# EAGLE design project (EAGLE 9.6.2)
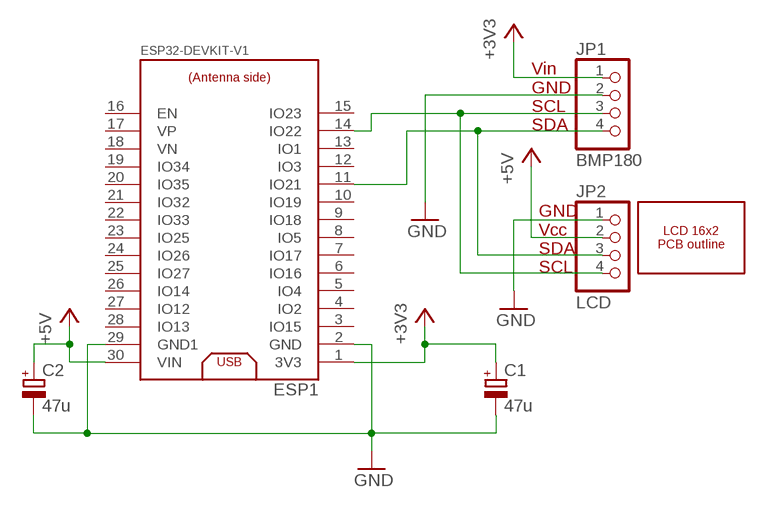
[diagram p0: schematic, sheet 1]

## Parts
C1  47u  CPOL-EUE2,5-6E  [E2,5-6E]
C2  47u  CPOL-EUE2,5-6E  [E2,5-6E]
ESP1  ESP32DEVKITV1  [ESP32-DEVKITV1]
JP1  BMP180  PINHD-1X4  [1X04]
JP2  LCD  PINHD-1X4  [1X04]
LCD1  OUTLINES  [LCD162-OUTLINE]

## Nets
+3V3: C1.+ ESP1.1(3V3) JP1.1
+5V: C2.+ ESP1.30(VIN) JP2.2
GND: C1.- C2.- ESP1.2(GND) ESP1.29(GND1) JP1.2 JP2.1
N$2: ESP1.14(IO22) JP1.3 JP2.4
N$3: ESP1.11(IO21) JP1.4 JP2.3
Unconnected: ESP1.3(IO15) ESP1.4(IO2) ESP1.5(IO4) ESP1.6(IO16) ESP1.7(IO17) ESP1.8(IO5) ESP1.9(IO18) ESP1.10(IO19) ESP1.12(IO3) ESP1.13(IO1) ESP1.15(IO23) ESP1.16(EN) ESP1.17(VP) ESP1.18(VN) ESP1.19(IO34) ESP1.20(IO35) ESP1.21(IO32) ESP1.22(IO33) ESP1.23(IO25) ESP1.24(IO26) ESP1.25(IO27) ESP1.26(IO14) ESP1.27(IO12) ESP1.28(IO13)

## Notes on the sheet
- Vin
  GND
  SCL
  SDA
- GND
  Vcc
  SDA
  SCL

## Library data of the parts
C1 C2 = rcl:CPOL-EU: POLARIZED CAPACITOR, European symbol; SPICEPREFIX: C
ESP1 = ESP32:ESP32DEVKITV1
JP1 JP2 = pinhead:PINHD-1X4: PIN HEADER
LCD1 = LCD-obrys:OUTLINES

## Board
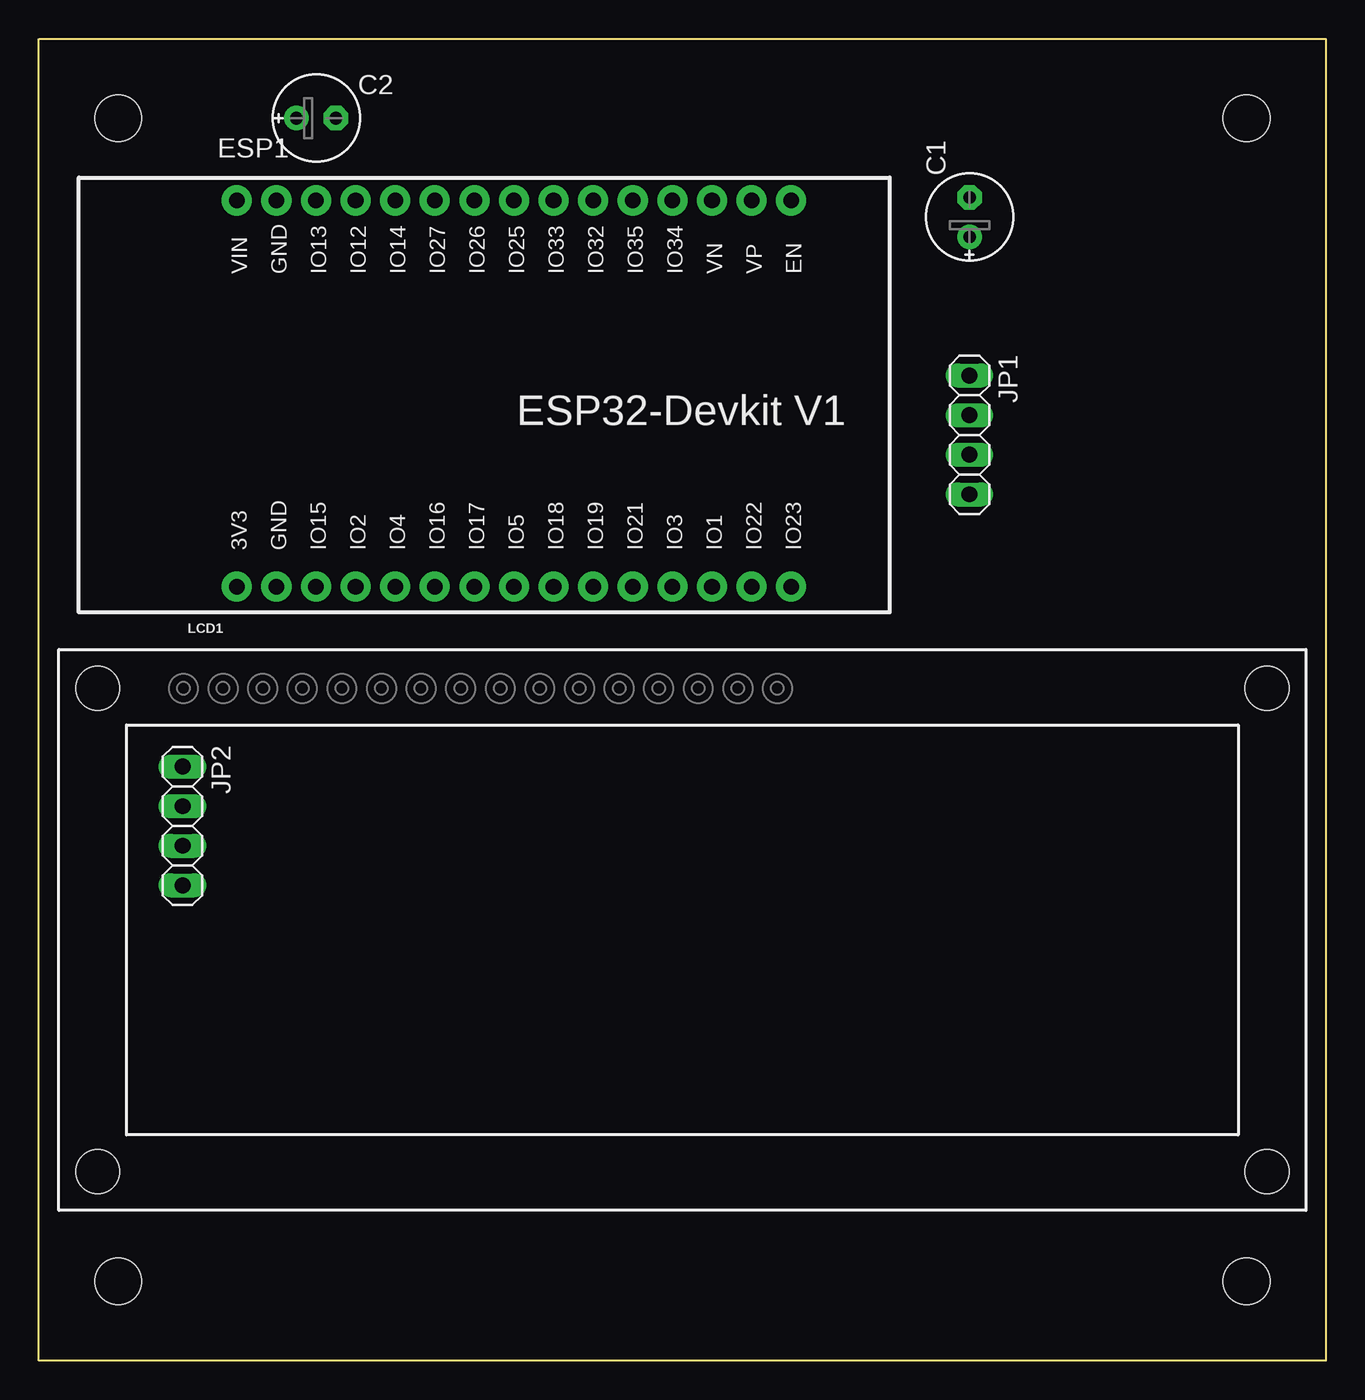
[diagram p1: board, top side]
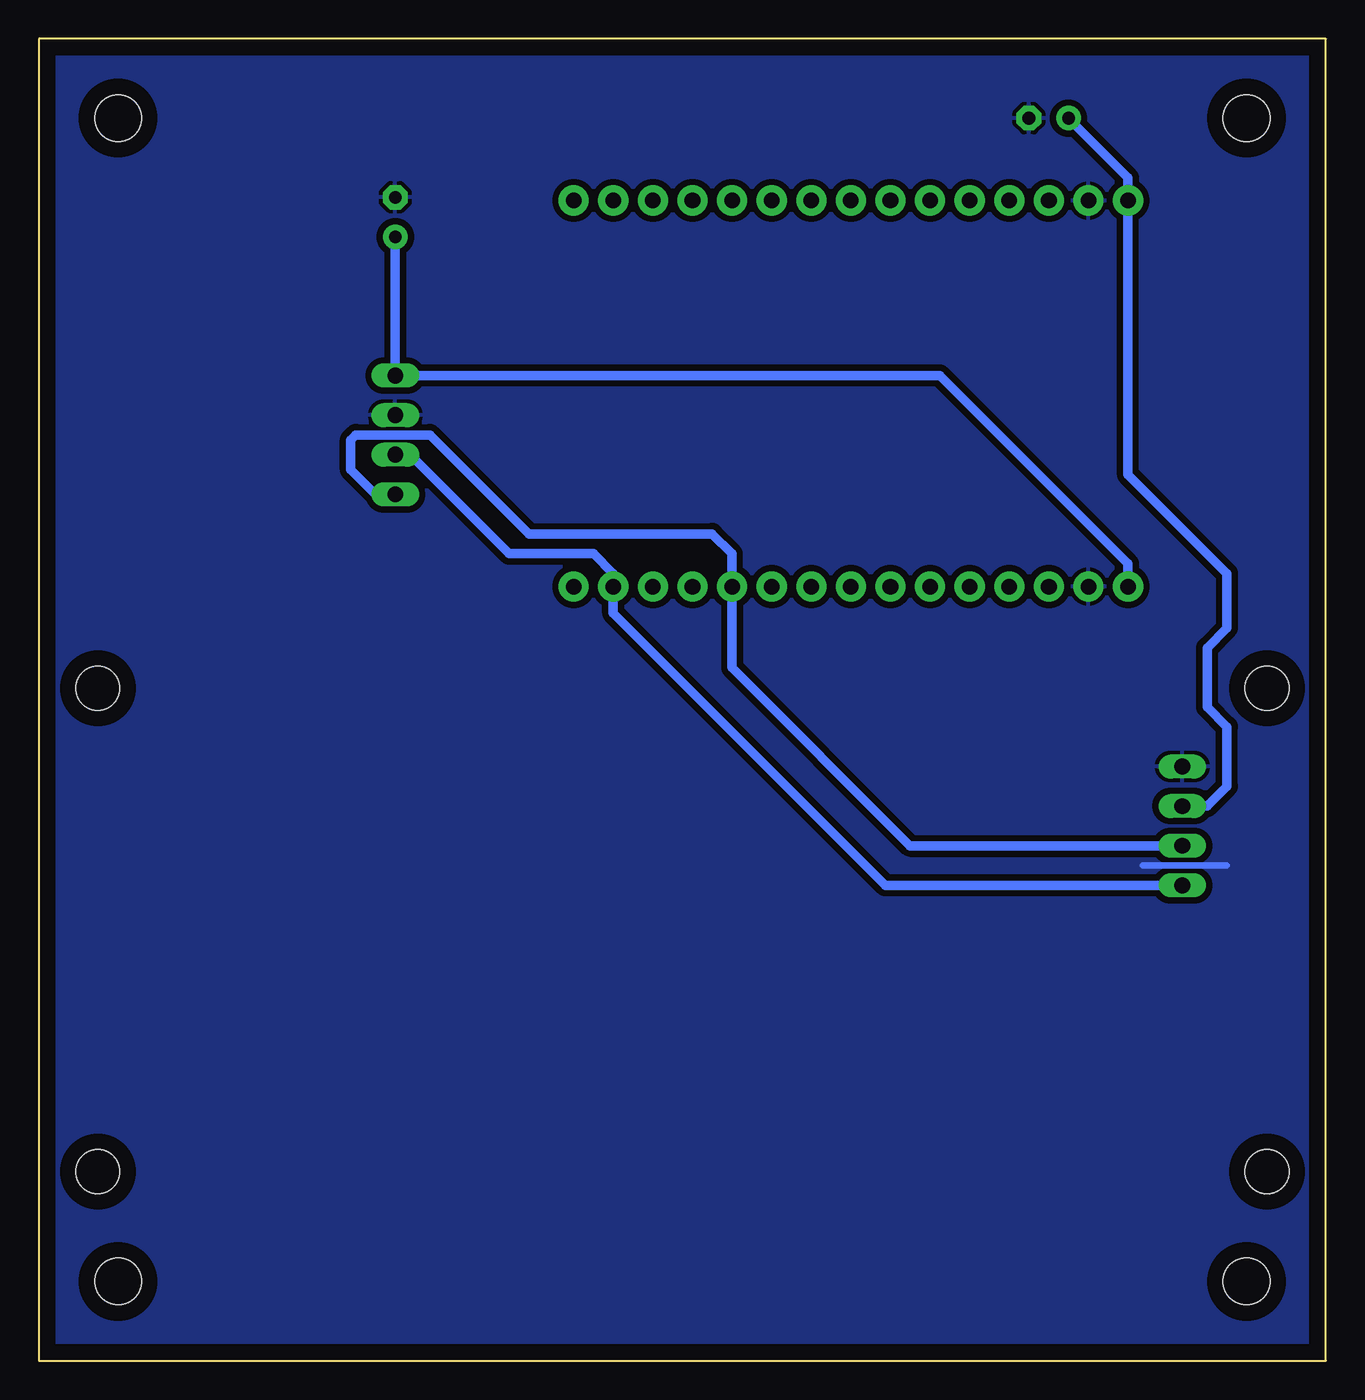
[diagram p2: board, bottom side, seen from below]

Size 82.55 x 84.77 mm. Coordinates in mm from the lower left corner, seen from the top.
Outline: 0,84.77 82.55,84.77 82.55,0 0,0 0,84.77
Copper layers (1*16): Top 0.035mm / dielectric 1.5mm / Bottom 0.035mm
Design rules "default": minimum track width 6mil, minimum drill 0.35mm, track to track 6mil, track to pad 6mil, pad to pad 6mil, via to via 6mil, smd to smd 6mil, copper to edge 40mil, drill to drill 6mil, minimum pad ring 10mil, minimum via ring 8mil, stop-mask expansion 4mil, vias tented up to drill 0mil, thermal gap 10mil
Holes 3 mm at 5.08,79.69 77.47,5.08 77.47,79.69 5.08,5.08

### Footprints (pad centres in the part's own frame; a part is rotated, then mirrored left to right if it is on the bottom)
E2,5-6E = drill 0.813 pad 1.575: + -1.27,0 | drill 0.813 pad 1.575 octagon: - 1.27,0
ESP32-DEVKITV1 = drill 1 pad 1.93: 1 -22.87,-13.54; 2 -20.33,-13.54; 3 -17.79,-13.54; 4 -15.25,-13.54; 5 -12.71,-13.54; 6 -10.17,-13.54; 7 -7.63,-13.54; 8 -5.09,-13.54; 9 -2.55,-13.54; 10 -0.01,-13.54; 11 2.53,-13.54; 12 5.07,-13.54; 13 7.61,-13.54; 14 10.15,-13.54; 15 12.69,-13.54; 16 12.69,11.23; 17 10.15,11.23; 18 7.61,11.23; 19 5.07,11.23; 20 2.53,11.23; 21 -0.01,11.23; 22 -2.55,11.23; 23 -5.09,11.23; 24 -7.63,11.23; 25 -10.17,11.23; 26 -12.71,11.23; 27 -15.25,11.23; 28 -17.79,11.23; 29 -20.33,11.23; 30 -22.87,11.23
1X04 = drill 1.016 long: 1 -3.81,0; 2 -1.27,0; 3 1.27,0; 4 3.81,0
LCD162-OUTLINE = hole 2.8: -37.5,15.5; -37.5,-15.5; 37.5,15.5; 37.5,-15.5

### Placement (x,y rotation side)
C1  59.69,73.34 90 top
C2  17.78,79.69 0 top
ESP1  35.56,63.18 0 top
JP1  59.69,59.37 270 top
JP2  9.21,34.29 270 top
LCD1  41.27,27.62 0 top

### Tracks (layer width: path | path; a pad name or v marks a point on that pad's centre or on a via)
+3V3
  Bottom 0.61: ESP1.1 12.69,51.11 24.77,63.18 JP1.1 C1.+
+5V
  Bottom 0.61: JP2.2 7.62,35.56 6.35,36.83 6.35,40.64 7.62,41.91 7.62,45.72 6.35,46.99 6.35,50.48 12.69,56.82 ESP1.30 12.69,75.87 C2.+
GND
  Bottom 0.406: 6.35,31.75 11.75,31.75
  pour Bottom (isolate 0.406): 0,84.77 82.55,84.77 82.55,0 0,0
N$2
  Bottom 0.61: 45.72,49.85 45.72,47.94 28.26,30.48 JP2.4 | 45.72,49.85 45.72,50.48 46.99,51.75 52.39,51.75 58.74,58.1 JP1.3 | ESP1.14 45.71,49.84 45.72,49.85
N$3
  Bottom 0.61: JP1.4 60.96,55.56 62.55,57.15 62.55,59.05 62.23,59.37 57.47,59.37 51.12,53.02 39.37,53.02 38.1,51.75 38.1,49.85 38.09,49.84 ESP1.11 38.09,44.44 26.67,33.02 JP2.3